# EAGLE design internal_env_board_with_LCD (EAGLE 9.6.1)
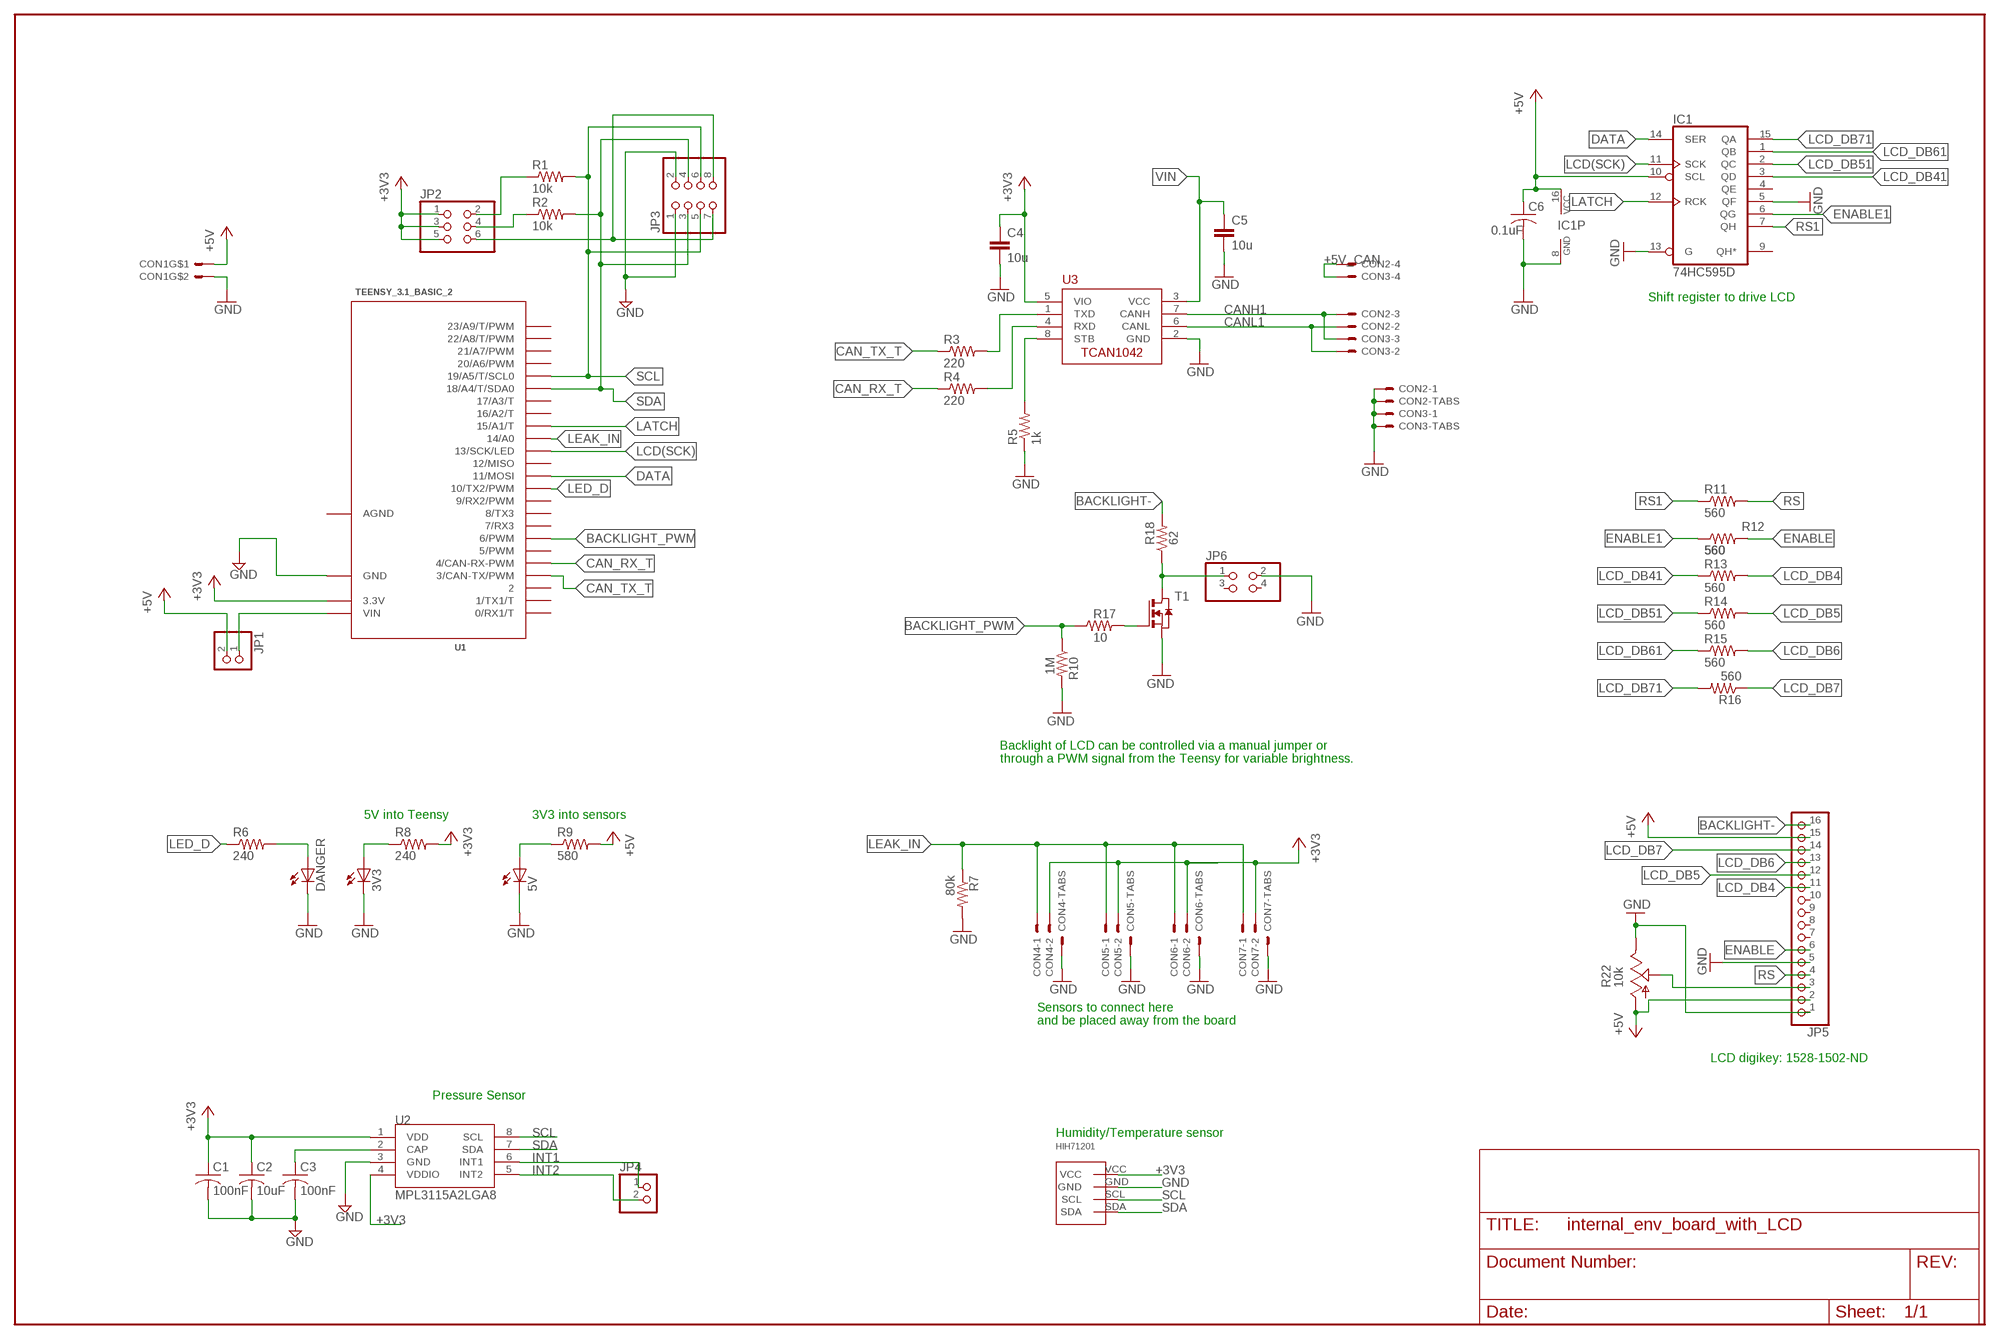
[diagram p0: schematic, sheet 1]

## Parts
3V3  LEDSMT1206  [1206]
5V  LEDSMT1206  [1206]
C1  100nF  C-USC1206  [C1206]
C2  10uF  C-USC1206  [C1206]
C3  100nF  C-USC1206  [C1206]
C4  10u  C-EUC0805  [C0805]
C5  10u  C-EUC0805  [C0805]
C6  0.1uF  C-USC2012  [C2012]
CON1  MOLEX_5566-2  [5566-2]
CON2  SM04B-GHS-TB  [SM04B-GHS-TB]
CON3  SM04B-GHS-TB  [SM04B-GHS-TB]
CON4  SM02B-GHS-TB  [SM02B-GHS-TB]
CON5  SM02B-GHS-TB  [SM02B-GHS-TB]
CON6  SM02B-GHS-TB  [SM02B-GHS-TB]
CON7  SM02B-GHS-TB  [SM02B-GHS-TB]
DANGER  LEDSMT1206  [1206]
HIH71201  HIH7120  [SIP4]
IC1  74HC595D  [SO16]
JP1  PINHD-1X2  [1X02]
JP2  PINHD-2X3  [2X03]
JP3  PINHD-2X4  [2X04]
JP4  PINHD-1X2  [1X02]
JP5  PINHD-1X16  [1X16]
JP6  PINHD-2X2  [2X02]
R1  10k  R-US_R1206  [R1206]
R2  10k  R-US_R1206  [R1206]
R3  220  R-US_R0805  [R0805]
R4  220  R-US_R0805  [R0805]
R5  1k  R-US_R0805  [R0805]
R6  240  R-US_R1206  [R1206]
R7  80k  R-US_R1206  [R1206]
R8  240  R-US_R1206  [R1206]
R9  580  R-US_R1206  [R1206]
R10  1M  R-US_R0805  [R0805]
R11  560  R-US_M2012  [M2012]
R12  560  R-US_M2012  [M2012]
R13  560  R-US_M2012  [M2012]
R14  560  R-US_M2012  [M2012]
R15  560  R-US_M2012  [M2012]
R16  560  R-US_M2012  [M2012]
R17  10  R-US_R0805  [R0805]
R18  62  R-US_R0805  [R0805]
R22  10k  TRIM_US-SM-42/43W  [SM-42/43W]
T1  NMOSSOT23  [SOT-23]
U1  TEENSY_3.1_BASIC_2  [TEENSY_3.1_BASIC_2]
U2  MPL3115A2LGA8  [LGA8]
U3  TCAN1042HVDR  [SO-8]

## Nets
+3V3: C1.1 C2.1 C4.1 CON4.P$2 CON5.P$2 CON6.P$2 CON7.P$2 HIH71201.VCC JP2.1 JP2.3 JP2.5 R8.2 U1.3.3V U2.1(VDD) U2.4(VDDIO) U3.5(VIO)
+5V: C6.1 CON1.1 IC1.10(SCL) IC1.16(VCC) JP1.2 JP5.2 JP5.15 R9.2 R22.1(A)
+5V_CAN: CON2.P$4 CON3.P$4
BACKLIGHT-: JP5.16 R18.2
BACKLIGHT_PWM: R10.1 R17.1 U1.6(6/PWM)
CAN_RX1: R4.2 U3.4(RXD)
CAN_RX_T: R4.1 U1.4(4/CAN-RX-PWM)
CAN_TX2: R3.2 U3.1(TXD)
CAN_TX_T: R3.1 U1.3(3/CAN-TX/PWM)
CANH1: CON2.P$3 CON3.P$3 U3.7(CANH)
CANL1: CON2.P$2 CON3.P$2 U3.6(CANL)
CAP: C3.1 U2.2(CAP)
DATA: IC1.14(SER) U1.11(11/MOSI)
ENABLE: JP5.6 R12.2
ENABLE1: IC1.6(QG) R12.1
GND: 3V3.C 5V.C C1.2 C2.2 C3.2 C4.2 C5.2 C6.2 CON1.2 CON2.P$1 CON2.P$5 CON2.P$6 CON3.P$1 CON3.P$5 CON3.P$6 CON4.P$3 CON4.P$4 CON5.P$3 CON5.P$4 CON6.P$3 CON6.P$4 CON7.P$3 CON7.P$4 DANGER.C HIH71201.GND IC1.5(QF) IC1.8(GND) IC1.13(G) JP3.1 JP3.2 JP5.1 JP5.5 JP6.2 R5.1 R7.2 R10.2 R22.3(E) T1.2(S) U1.GND U2.3(GND) U3.2(GND)
I2C_3V1: JP2.6 JP3.7 JP3.8
INT1: JP4.1 U2.6(INT1)
INT2: JP4.2 U2.5(INT2)
LATCH: IC1.12(RCK) U1.15/A1(15/A1/T)
LCD(SCK): IC1.11(SCK) U1.13(13/SCK/LED)
LCD_DB4: JP5.11 R13.2
LCD_DB5: JP5.12 R14.2
LCD_DB6: JP5.13 R15.2
LCD_DB7: JP5.14 R16.1
LCD_DB41: IC1.3(QD) R13.1
LCD_DB51: IC1.2(QC) R14.1
LCD_DB61: IC1.1(QB) R15.1
LCD_DB71: IC1.15(QA) R16.2
LEAK_IN: CON4.P$1 CON5.P$1 CON6.P$1 CON7.P$1 R7.1 U1.14/A0
LED_D: R6.1 U1.10(10/TX2/PWM)
N$2: DANGER.A R6.2
N$4: 5V.A R9.1
N$8: R17.2 T1.3(G)
N$12: JP6.1 R18.1 T1.1(D)
N$17: 3V3.A R8.1
N$18: JP5.3 R22.2(S)
RS: JP5.4 R11.2
RS1: IC1.7(QH) R11.1
SCL: HIH71201.SCL JP3.5 JP3.6 R1.2 U1.19/A5(19/A5/T/SCL0) U2.8(SCL)
SCL_3V1: JP2.2 R1.1
SDA: HIH71201.SDA JP3.3 JP3.4 R2.2 U1.18/A4(18/A4/T/SDA0) U2.7(SDA)
SDA_3V1: JP2.4 R2.1
STB1: R5.2 U3.8(STB)
VIN: C5.1 JP1.1 U1.VIN U3.3(VCC)
Unconnected: IC1.4(QE) IC1.9(QH*) JP5.7 JP5.8 JP5.9 JP5.10 JP6.3 JP6.4 U1.0(0/RX1/T) U1.1(1/TX1/T) U1.2 U1.5(5/PWM) U1.7(7/RX3) U1.8(8/TX3) U1.9(9/RX2/PWM) U1.12(12/MISO) U1.16/A2(16/A2/T) U1.17/A3(17/A3/T) U1.20/A6(20/A6/PWM) U1.21/A7(21/A7/PWM) U1.22/A8(22/A8/T/PWM) U1.23/A9(23/A9/T/PWM)

## Notes on the sheet
- Shift register to drive LCD
- Backlight of LCD can be controlled via a manual jumper or
  through a PWM signal from the Teensy for variable brightness.
- 5V into Teensy | 3V3 into sensors
- Sensors to connect here
  and be placed away from the board
- LCD digikey: 1528-1502-ND
- Pressure Sensor
- Humidity/Temperature sensor

## Power pins joined to a net without a drawn wire
AGND: U1.AGND

## Library data of the parts
3V3 5V DANGER = adafruit:LED: LED OSRAM: - CHIPLED LG R971, LG N971, LY N971, LG Q971, LY Q971, LO R971, LY R971 LH N974, LH R974 LS Q976, LO Q976, LY Q976 LO Q996 - Hyper CHIPLED LW Q18S LB Q993, LB Q99A, LB R99A - SideLED LS A670, LO A670, LY A670, LG A670, LP A670 LB A673, LV A673, LT A673, LW A673 LH A674 LY A675 LS A676, LA A676, LO A676, LY A676, LW A676 LS A679, LY A679, LG A679 - Hyper Micro SIDELED® LS Y876, LA Y876, LO Y876, LY Y876 LT Y87S - SmartLED LW L88C, LW L88S LB L89C, LB L89S, LG L890 LS L89K, LO L89K, LY L89K LS L896, LA L896, LO L896, LY L896 - TOPLED LS T670, LO T670, LY T670, LG T670, LP T670 LSG T670, LSP T670, LSY T670, LOP T670, LYG T670 LG T671, LOG T671, LSG T671 LB T673, LV T673, LT T673, LW T673 LH T674 LS T676, LA T676, LO T676, LY T676, LB T676, LH T676, LSB T676, LW T676 LB T67C, LV T67C, LT T67C, LS T67K, LO T67K, LY T67K, LW E67C LS E67B, LA E67B, LO E67B, LY E67B, LB E67C, LV E67C, LT E67C LW T67C LS T679, LY T679, LG T679 LS T770, LO T770, LY T770, LG T770, LP T770 LB T773, LV T773, LT T773, LW T773 LH T774 LS E675, LA E675, LY E675, LS T675 LS T776, LA T776, LO T776, LY T776, LB T776 LHGB T686 LT T68C, LB T68C - Hyper Mini TOPLED® LB M676 - Mini TOPLED Santana® LG M470 LS M47K, LO M47K, LY M47K Source: http://www.osram.convergy.de/
C1-C3 = rcl:C-US: CAPACITOR, American symbol
C4 C5 = rcl:C-EU: CAPACITOR, European symbol
C6 = resistor:C-US: CAPACITOR, American symbol
CON1 = ARVP:MOLEX_5566-2
CON2 CON3 = ARVP:SM04B-GHS-TB
CON4-CON7 = ARVP:SM02B-GHS-TB
HIH71201 = HIH7120:HIH7120: A humidity and temperature sensor from honeywell. 2.3-5V operating voltage -40 to 85 temperature range Digikey Part #: HIH7120-021-001CT-ND
IC1 = 74xx-eu:74*595: 8-bit SHIFT REGISTER, output latch
JP1 JP4 = pinhead:PINHD-1X2: PIN HEADER
JP2 = pinhead:PINHD-2X3: PIN HEADER
JP3 = pinhead:PINHD-2X4: PIN HEADER
JP5 = pinhead:PINHD-1X16: PIN HEADER
JP6 = pinhead:PINHD-2X2: PIN HEADER
R1-R5 R10-R18 = rcl:R-US_: RESISTOR, American symbol
R6-R9 = resistor:R-US_: RESISTOR, American symbol
R22 = pot:TRIM_US-: POTENTIOMETER
T1 = zetex:NMOSSOT23: MOS FET; OC_FARNELL: unknown; OC_NEWARK: unknown
U1 = Teensy_3_Series_Board_v1.0:TEENSY_3.1_BASIC_2: Footprint for Teensy 3.1 board using all pin connections on the outer perimeter
U2 = SparkFun-Sensors:MPL3115A2: Altimeter/Pressure Sensor, I2C, 1.95V-3.6V supply, 50 to 110kPa
U3 = ARVP:TCAN1042HVDR

## Net classes
1 net1: clearance 0.203 mm to class 0

## Board
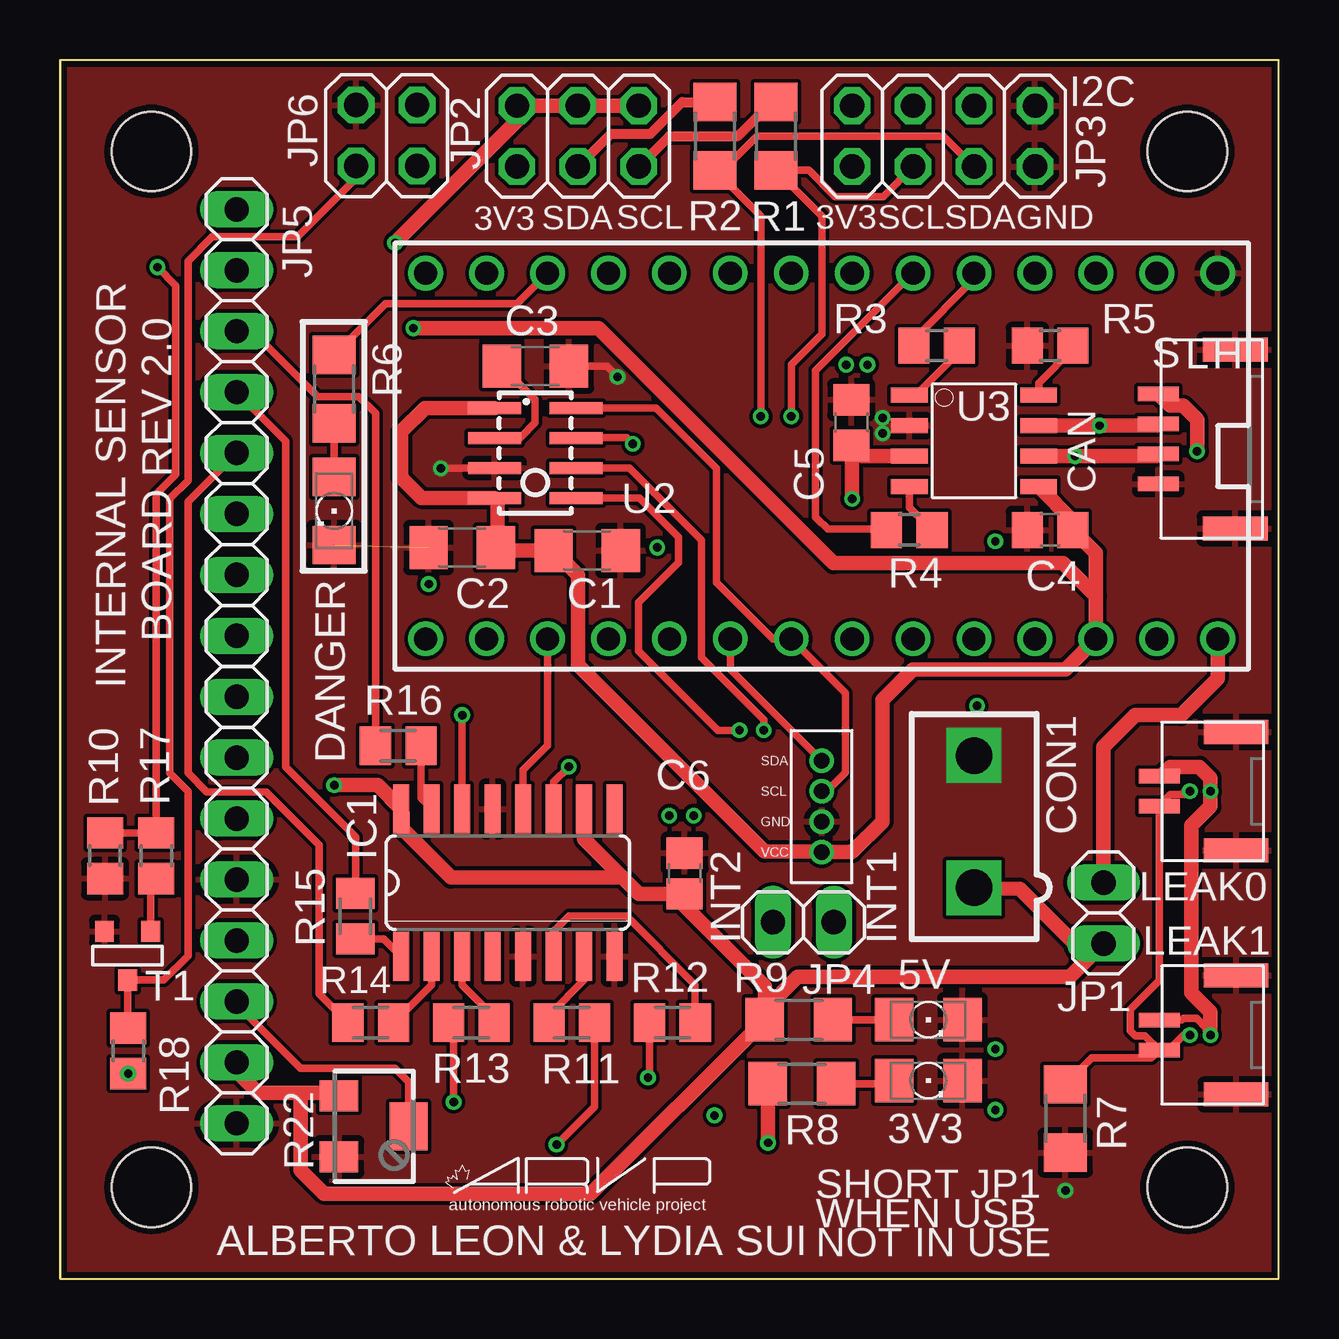
[diagram p1: board, top side]
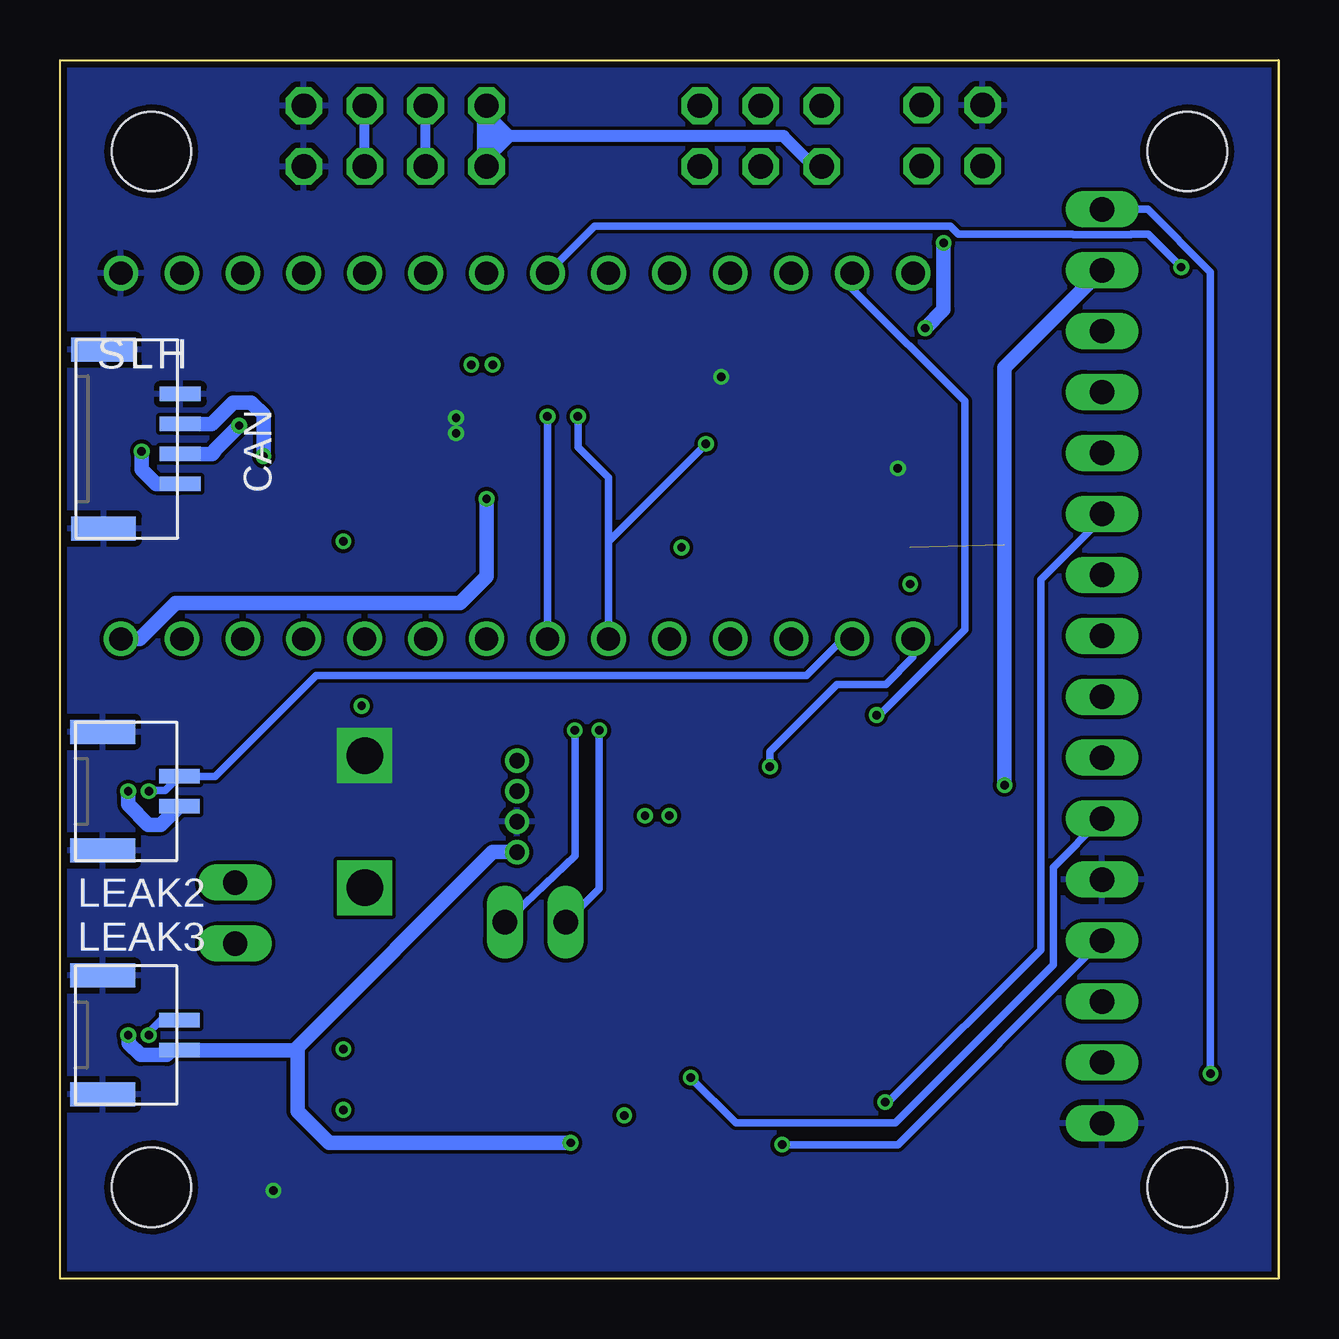
[diagram p2: board, bottom side, seen from below]

Size 50.8 x 50.8 mm. Coordinates in mm from the lower left corner, seen from the top.
Outline: 0,0 50.8,0 50.8,50.8 0,50.8 0,0
Copper layers (1*16): Top 0.035mm / dielectric 1.5mm / Bottom 0.035mm
Design rules "JLCPCB2Layer": minimum track width 6mil, minimum drill 10mil, track to track 6mil, track to pad 6mil, pad to pad 6mil, via to via 6mil, smd to smd 0mil, copper to edge 10mil, drill to drill 10mil, minimum pad ring 6mil, minimum via ring 6mil, stop-mask expansion 2mil, vias tented up to drill 100mil, thermal gap 10mil
Milling: 4 lines

### Footprints (pad centres in the part's own frame; a part is rotated, then mirrored left to right if it is on the bottom)
1206 = smd 1.6 x 1.803: A -1.422,0; C 1.422,0
C1206 = smd 1.6 x 1.8: 1 -1.4,0; 2 1.4,0
C0805 = smd 1.3 x 1.5: 1 -0.95,0; 2 0.95,0
C2012 = smd 1.3 x 1.5: 1 -0.85,0; 2 0.85,0
5566-2 = drill 1.524 square: 1 0,-2.756; 2 0,2.756
SM04B-GHS-TB = smd 0.6 x 1.7: P$1 -1.875,0.85; P$2 -0.625,0.85; P$3 0.625,0.85; P$4 1.875,0.85 | smd 1 x 2.7: P$5 -3.725,-2.35; P$6 3.725,-2.35
SM02B-GHS-TB = smd 0.6 x 1.7: P$1 -0.625,0.85; P$2 0.625,0.85 | smd 1 x 2.7: P$3 -2.475,-2.35; P$4 2.475,-2.35
SIP4 = drill 0.635 pad 1.016: GND -1.27,0; SCL 0,0; SDA 1.27,0; VCC -2.54,0
SO16 = smd 0.66 x 2.032: 1 -4.445,-3.073; 2 -3.175,-3.073; 3 -1.905,-3.073; 4 -0.635,-3.073; 5 0.635,-3.073; 6 1.905,-3.073; 7 3.175,-3.073; 8 4.445,-3.073; 9 4.445,3.073; 10 3.175,3.073; 11 1.905,3.073; 12 0.635,3.073; 13 -0.635,3.073; 14 -1.905,3.073; 15 -3.175,3.073; 16 -4.445,3.073
1X02 = drill 1.016 long: 1 -1.27,0; 2 1.27,0
2X03 = drill 1.016 octagon: 1 -2.54,-1.27; 2 -2.54,1.27; 3 0,-1.27; 4 0,1.27; 5 2.54,-1.27; 6 2.54,1.27
2X04 = drill 1.016 octagon: 1 -3.81,-1.27; 2 -3.81,1.27; 3 -1.27,-1.27; 4 -1.27,1.27; 5 1.27,-1.27; 6 1.27,1.27; 7 3.81,-1.27; 8 3.81,1.27
1X16 = drill 1.016 long: 1 -19.05,0; 2 -16.51,0; 3 -13.97,0; 4 -11.43,0; 5 -8.89,0; 6 -6.35,0; 7 -3.81,0; 8 -1.27,0; 9 1.27,0; 10 3.81,0; 11 6.35,0; 12 8.89,0; 13 11.43,0; 14 13.97,0; 15 16.51,0; 16 19.05,0
2X02 = drill 1.016 octagon: 1 -1.27,-1.27; 2 -1.27,1.27; 3 1.27,-1.27; 4 1.27,1.27
R1206 = smd 1.6 x 1.803: 1 -1.422,0; 2 1.422,0
R0805 = smd 1.3 x 1.5: 1 -0.95,0; 2 0.95,0
M2012 = smd 1.3 x 1.6: 1 -0.95,0; 2 0.95,0
SM-42/43W = smd 1.3 x 1.6: 1 -1.27,-1.45; 3 1.27,-1.45 | smd 2 x 1.6: 2 0,1.45
SOT-23 = smd 0.787 x 0.889: 1 0.025,-1.016; 2 -0.94,1.016; 3 0.991,1.016
TEENSY_3.1_BASIC_2 = drill 0.965: 0 -7.62,13.97; 1 -7.62,11.43; 2 -7.62,8.89; 3 -7.62,6.35; 3.3V 7.62,11.43; 4 -7.62,3.81; 5 -7.62,1.27; 6 -7.62,-1.27; 7 -7.62,-3.81; 8 -7.62,-6.35; 9 -7.62,-8.89; 10 -7.62,-11.43; 11 -7.62,-13.97; 12 -7.62,-16.51; 13 7.62,-16.51; 14/A0 7.62,-13.97; 15/A1 7.62,-11.43; 16/A2 7.62,-8.89; 17/A3 7.62,-6.35; 18/A4 7.62,-3.81; 19/A5 7.62,-1.27; 20/A6 7.62,1.27; 21/A7 7.62,3.81; 22/A8 7.62,6.35; 23/A9 7.62,8.89; AGND 7.62,13.97; GND -7.62,16.51; VIN 7.62,16.51
LGA8 = smd 2.2 x 0.5: 1 -1.7,1.875; 2 -1.7,0.625; 3 -1.7,-0.625; 4 -1.7,-1.875; 5 1.7,-1.875; 6 1.7,-0.625; 7 1.7,0.625; 8 1.7,1.875
SO-8 = smd 1.524 x 0.61: 1 -2.692,1.905; 2 -2.692,0.635; 3 -2.692,-0.635; 4 -2.692,-1.905; 5 2.692,-1.905; 6 2.692,-0.635; 7 2.692,0.635; 8 2.692,1.905
STAND-OFF = hole 3.302: 0,0

### Placement (x,y rotation side)
3V3  36.19,8.26 0 top
5V  36.19,10.8 0 top
C1  21.97,30.35 0 top
C2  16.76,30.48 180 top
C3  19.81,38.04 0 top
C4  41.27,31.21 180 top
C5  32.99,35.69 90 top
C6  26.03,16.89 90 top
CON1  38.1,19.05 0 top
CON2  46.63,35 90 top
CON3  46.63,35 270 bottom
CON4  46.67,10.16 270 bottom
CON5  46.67,20.32 270 bottom
CON6  46.67,10.16 90 top
CON7  46.67,20.32 90 top
DANGER  11.43,32 270 top
HIH71201  31.75,20.32 90 top
IC1  18.67,16.51 0 top
JP1  43.5,15.24 270 top
JP2  21.59,47.62 180 top
JP3  36.83,47.62 180 top
JP4  30.99,14.86 180 top
JP5  7.37,25.53 90 top
JP6  13.61,47.65 0 top
R1  29.84,47.62 270 top
R2  27.3,47.62 270 top
R3  36.54,38.89 0 top
R4  35.4,31.21 0 top
R5  41.27,38.89 0 top
R6  11.43,37.08 270 top
R7  41.91,6.68 270 top
R8  30.92,8.13 180 top
R9  30.8,10.8 180 top
R10  1.88,17.63 270 top
R11  21.34,10.67 0 top
R12  25.53,10.67 180 top
R13  17.14,10.67 180 top
R14  12.95,10.67 180 top
R15  12.32,15.11 90 top
R16  14.1,22.22 0 top
R17  4.01,17.63 270 top
R18  2.84,9.5 270 top
R22  13.08,6.35 270 top
T1  2.79,13.46 0 top
U1  31.75,34.29 270 top
U2  19.81,34.42 0 top
U3  38.1,34.92 0 top
U$1  [LOGO2]  16.21,2.84 0 top
U$4  [A5L-LOC]  -67.92,-53.39 0 top  (outside the outline)
U$5  [STAND-OFF]  46.99,3.81 0 top
U$6  [STAND-OFF]  3.81,3.81 0 top
U$7  [STAND-OFF]  3.81,46.99 0 top
U$8  [STAND-OFF]  46.99,46.99 0 top

### Tracks (layer width: path | path; a pad name or v marks a point on that pad's centre or on a via)
+3V3  (via drill 0.35)
  Top 0.305: v47.96,10.16 47.78,10.34 47.78,10.44 47.38,10.84 46.82,10.84 46.76,10.79 CON6.P$2 | 29.5,7.11 R8.2
  Top 0.61: JP2.1 JP2.3 JP2.5 19.05,48.26 v13.97,43.18 | U3.5 42.23,31.59 C4.1 43.18,30.26 43.18,28.45 | 43.18,28.45 U1.3.3V 41.91,25.4 35.56,25.4 34.29,24.13 34.29,19.05 33.02,17.78 HIH71201.VCC 31.73,17.8 29.37,17.8 21.59,25.58 21.59,29.33 C1.1 18.44,30.35 18.24,30.56 | v14.73,39.62 22.44,39.62 32.24,29.83 41.8,29.83 43.18,28.45 | 18.24,30.56 C2.1 | 18.24,30.56 18.24,32.42 U2.4 15.08,32.54 14.22,33.4 14.22,35.31 15.21,36.29 U2.1 | v47.96,10.16 47.96,11.13 47.16,11.92 47.16,18.89 47.96,19.69 v47.96,20.32 47.96,20.88 47.5,21.33 46.28,21.33 45.89,20.95 CON7.P$2 | 29.5,7.11 29.51,7.1 v29.51,5.66
  Bottom 0.305: CON4.P$2 46.14,9.54
  Bottom 0.61: v14.73,39.62 13.97,40.39 v13.97,43.18 | v47.96,10.16 47.93,10.14 47.93,9.81 47.44,9.32 46.35,9.32 46.14,9.54 | v47.96,20.32 47.93,20.3 47.96,20.28 47.96,19.76 47.12,18.92 46.59,18.92 CON5.P$2 | v29.51,5.66 39.57,5.66 40.89,6.99 40.89,9.65 | 40.89,9.65 32.77,17.78 HIH71201.VCC | CON4.P$2 45.81,9.53 41.02,9.53 40.89,9.65
+5V  (via drill 0.35)
  Top 0.61: 10.03,7.75 11.5,7.75 R22.1 | R9.2 29.38,12.19 26.04,15.53 C6.1 24.13,16.04 23.45,16.72 | IC1.10 21.84,18.33 23.45,16.72 | 23.45,16.72 16.29,16.72 14.27,18.74 14.27,19.41 14.22,19.46 IC1.16 13.23,20.57 v11.43,20.57 | CON1.1 40.01,16.26 42.29,13.97 JP1.2 42.1,12.57 30.73,12.57 29.38,11.21 R9.2 | R9.2 22.12,3.54 11,3.54 10.03,4.51 10.03,7.75 | JP5.2 7.37,8.64 8.26,7.75 10.03,7.75
  Bottom 0.61: v11.43,20.57 11.43,37.97 JP5.15
+5V_CAN  (via drill 0.35)
  Top 0.61: CON2.P$4 46.28,36.38 46.82,36.38 47.4,35.81 v47.4,34.49
  Bottom 0.61: v47.4,34.49 47.4,33.73 46.79,33.13 CON3.P$4
BACKLIGHT-  (via drill 0.35)
  Bottom 0.305: R18.2 2.84,41.96 5.46,44.58 JP5.16
  other vias: 2.84,8.55
BACKLIGHT_PWM  (via drill 0.35)
  Top 0.305: R10.1 R17.1 4.01,32.72 4.83,33.53 4.83,41.4 v4.06,42.16
  Bottom 0.305: U1.6 28.53,43.86 13.69,43.86 13.36,43.54 8.6,43.54 8.57,43.51 6.16,43.51 6.14,43.54 5.44,43.54 v4.06,42.16
CAN_RX1
  Top 0.305: R4.2 35.41,32.15 U3.4
CAN_RX_T
  Top 0.152: 31.5,31.75 31.56,31.69
  Top 0.305: U1.4 31.5,37.85 31.5,31.75 | 31.56,31.69 32.01,31.24 34.42,31.24 R4.1
CAN_TX2
  Top 0.305: U3.1 35.68,36.83 37.49,38.64 R3.2
CAN_TX_T
  Top 0.305: U1.3 38.1,41.66 35.59,39.15 R3.1
CANH1  (via drill 0.35)
  Top 0.61: 40.81,35.54 U3.7 v43.33,35.56 45.72,35.56 CON2.P$3
  Bottom 0.61: v43.33,35.56 44.35,34.54 44.35,34.49 44.47,34.38 CON3.P$3
CANL1  (via drill 0.35)
  Top 0.61: U3.6 v42.32,34.29 45.7,34.29 CON2.P$2
  Bottom 0.61: CON3.P$2 44.49,35.63 43.59,36.53 42.82,36.53 42.32,36.02 v42.32,34.29 42.32,34.24
CAP
  Top 0.305: C3.1 19.81,36.64 19.81,35.69 19.17,35.04 U2.2
DATA  (via drill 0.35)
  Top 0.305: IC1.14 v16.76,23.5
  Bottom 0.305: U1.11 17.78,41.28 13.08,36.58 13.08,27.05 16.64,23.5 v16.76,23.5
ENABLE  (via drill 0.35)
  Top 0.305: R12.2 24.58,8.45 v24.51,8.38
  Bottom 0.305: JP5.6 9.4,17.15 9.4,13.08 15.98,6.5 22.63,6.5 v24.51,8.38
ENABLE1
  Top 0.305: R12.1 26.48,12.26 23.62,15.11 21.21,15.11 20.57,14.48 IC1.6
GND  (via drill 0.35)  (1 unrouted)
  Top 0.305: C3.2 22.8,38.04 v23.24,37.59 | U2.3 15.89,33.79 v15.88,33.78
  other vias: 34.29,35.88 34.29,35.24 41.91,3.67
  pour Bottom (rank 2): 0.32,0.32 50.48,0.32 50.48,50.48 0.32,50.48
  pour Top (rank 3): 0.32,0.32 50.48,0.32 50.48,50.48 0.32,50.48
  pour Top (no thermals): 36.54,19.65 39.66,19.65 39.66,23.78 36.54,23.78
  pour Bottom (no thermals): 36.54,19.65 39.66,19.65 39.66,23.78 36.54,23.78
I2C_3V1
  Bottom 0.508: JP2.6 19.37,46.36 20.64,47.63 33.02,47.63 | 33.02,48.58 32.07,47.63 33.02,46.67
  Bottom 0.813: JP3.7 33.02,48.58 33.02,47.63 33.02,46.67 JP3.8
INT1  (via drill 0.35)
  Top 0.305: v29.34,22.86 29.34,23.28 26.73,25.89 26.73,30.8 23.74,33.79 U2.6
  Bottom 0.305: JP4.1 29.34,17.63 v29.34,22.86
INT2  (via drill 0.35)
  Top 0.305: U2.5 24.15,32.54 25.78,30.91 25.78,29.85 24.12,28.18 24.12,26.17 27.43,22.86 v28.32,22.86
  Bottom 0.305: v28.32,22.86 28.32,16.26 JP4.2
LATCH
  Top 0.305: IC1.12 19.3,21.21 20.32,22.23 U1.15/A1
LCD(SCK)  (via drill 0.35)
  Top 0.305: IC1.11 20.57,20.7 v21.21,21.34
  Bottom 0.305: v21.21,21.34 21.21,21.97 18.42,24.77 16.38,24.77 15.24,25.91 U1.13
LCD_DB4  (via drill 0.35)
  Top 0.305: v16.41,7.36 16.41,10.45 R13.2
  Bottom 0.305: JP5.11 7.37,31.68 9.91,29.14 9.91,13.72 16.26,7.36 v16.41,7.36
LCD_DB5
  Top 0.305: R14.2 10.8,11.88 10.8,18.09 8.59,20.29 6.12,20.29 5.33,21.08 5.33,32.39 JP5.12
LCD_DB6
  Top 0.305: R15.2 12.32,18.42 9.4,21.34 9.4,34.93 JP5.13
LCD_DB7
  Top 0.305: R16.1 13.15,36.08 12.46,36.77 10.73,36.77 8,39.5 JP5.14
LCD_DB41
  Top 0.305: IC1.3 16.76,12.25 18.1,10.92 R13.1
LCD_DB51
  Top 0.305: IC1.2 15.49,12.26 R14.1
LCD_DB61
  Top 0.305: R15.1 13.5,14.16 IC1.1
LCD_DB71
  Top 0.305: R16.2 15.05,20.03 IC1.15
LEAK_IN  (via drill 0.35)
  Top 0.305: R7.1 43.02,9.21 45.5,9.21 CON6.P$1 | CON6.P$1 45.23,10.13 44.83,10.13 44.62,10.34 44.62,11.23 45.82,12.44 CON7.P$1 45.82,19.73 46.29,20.19 46.97,20.19 v47.1,20.32 | CON6.P$1 46.23,9.54 46.85,10.16 v47.1,10.16
  Bottom 0.305: v47.1,20.32 46.85,20.32 46.82,20.35 46.42,20.35 CON5.P$1 44.33,20.95 40.13,25.15 19.69,25.15 18.16,26.67 U1.14/A0 | CON4.P$1 46.58,10.79 47.08,10.29 47.08,10.18 v47.1,10.16
LED_D
  Top 0.305: R6.1 13.56,40.64 19.05,40.64 U1.10
N$1  (via drill 0.35)
  other vias: 27.28,6.81
N$2
  Top 0.305: R6.2 DANGER.A
N$3  (via drill 0.35)
  other vias: 25.4,19.3
N$4
  Top 0.305: 5V.A R9.1
N$5  (via drill 0.35)
  other vias: 26.42,19.3
N$6  (via drill 0.35)
  other vias: 15.37,28.96
N$7  (via drill 0.35)
  other vias: 24.89,30.48
N$8
  Top 0.305: R17.2 3.78,16.45 T1.3
N$9  (via drill 0.35)
  other vias: 32.77,38.1
N$10  (via drill 0.35)
  other vias: 33.66,38.1
N$11  (via drill 0.35)
  other vias: 38.99,30.73
N$12
  Top 0.305: R18.1 2.82,10.48 T1.1 4.32,12.45 5.33,13.46 5.33,20.32 4.57,21.08 4.57,32.51 5.33,33.27 5.33,42.42 6.35,43.43 9.91,43.43 12.34,45.87 JP6.1
N$13  (via drill 0.35)
  other vias: 38.99,7.04
N$14  (via drill 0.35)
  other vias: 38.99,9.58
N$17
  Top 0.305: R8.1 34.65,8.13 3V3.A
N$18
  Top 0.305: R22.2 14.53,8.2 13.97,8.76 10.03,8.76 7.37,11.43 JP5.3
N$20  (via drill 0.35)
  other vias: 38.23,23.88
RS  (via drill 0.35)
  Top 0.305: 22.29,7.17 R11.2 | v20.7,5.59 22.29,7.17 | 22.29,7.17
  Bottom 0.305: v20.7,5.59 15.88,5.59 JP5.4
RS1
  Top 0.305: R11.1 20.46,10.67 20.46,11.06 21.84,12.45 IC1.7
SCL  (via drill 0.35)
  Top 0.305: JP3.6 34.32,45.11 32.3,45.11 31.21,46.2 R1.2 31.75,44.3 31.75,39.37 30.48,38.1 v30.48,35.94 | U2.8 24.84,36.29 27.37,33.76 27.37,29.02 29.72,26.67 U1.19/A5 32.74,24.41 32.74,21.11 31.96,20.32 HIH71201.SCL
  Bottom 0.305: v30.48,35.94 U1.19/A5
  Bottom 0.406: JP3.6 JP3.5
SCL_3V1
  Top 0.406: JP2.2 25.4,47.63 28.26,47.63 29.68,49.05 R1.1
SDA  (via drill 0.35)
  Top 0.305: JP3.4 36.83,47.63 29.05,47.63 27.63,46.2 R2.2 29.21,44.3 v29.21,35.94 | HIH71201.SDA 27.94,25.4 U1.18/A4 | v23.88,34.8 23.62,35.05 21.52,35.05 U2.7
  Bottom 0.305: v29.21,35.94 29.21,34.67 27.94,33.4 27.94,30.73 | 27.94,30.73 U1.18/A4 | v23.88,34.8 27.94,30.73
  Bottom 0.406: JP3.4 JP3.3
SDA_3V1
  Top 0.406: JP2.4 22.96,47.73 24.61,47.73 25.93,49.05 R2.1
STB1
  Top 0.305: U3.8 40.79,37.33 42.23,38.77 R5.2
VIN  (via drill 0.35)
  Top 0.61: v33.02,32.51 33.02,34.71 C5.1 33.44,34.29 U3.3 | U1.VIN 48.26,25.02 46.74,23.5 44.83,23.5 43.5,22.16 JP1.1
  Bottom 0.61: U1.VIN 47.48,26.67 45.98,28.17 34.12,28.17 33.02,29.27 v33.02,32.51

### Text on the board
tNames: I2C | 3V3 | SDA | SCL | 3V3 | SCL | SDA | GND | S | L | H | CAN | INTERNAL SENSOR / BOARD REV 2.0 | LEAK0 | INT2 | INT1 | LEAK1 | SHORT JP1 / WHEN USB / NOT IN USE | ALBERTO LEON & LYDIA SUI
bNames: H | L | S | CAN | LEAK2 | LEAK3
Document: Revision | 2.0